# Altium schematic sheet wisp-5-peripherals.SchDoc
size A
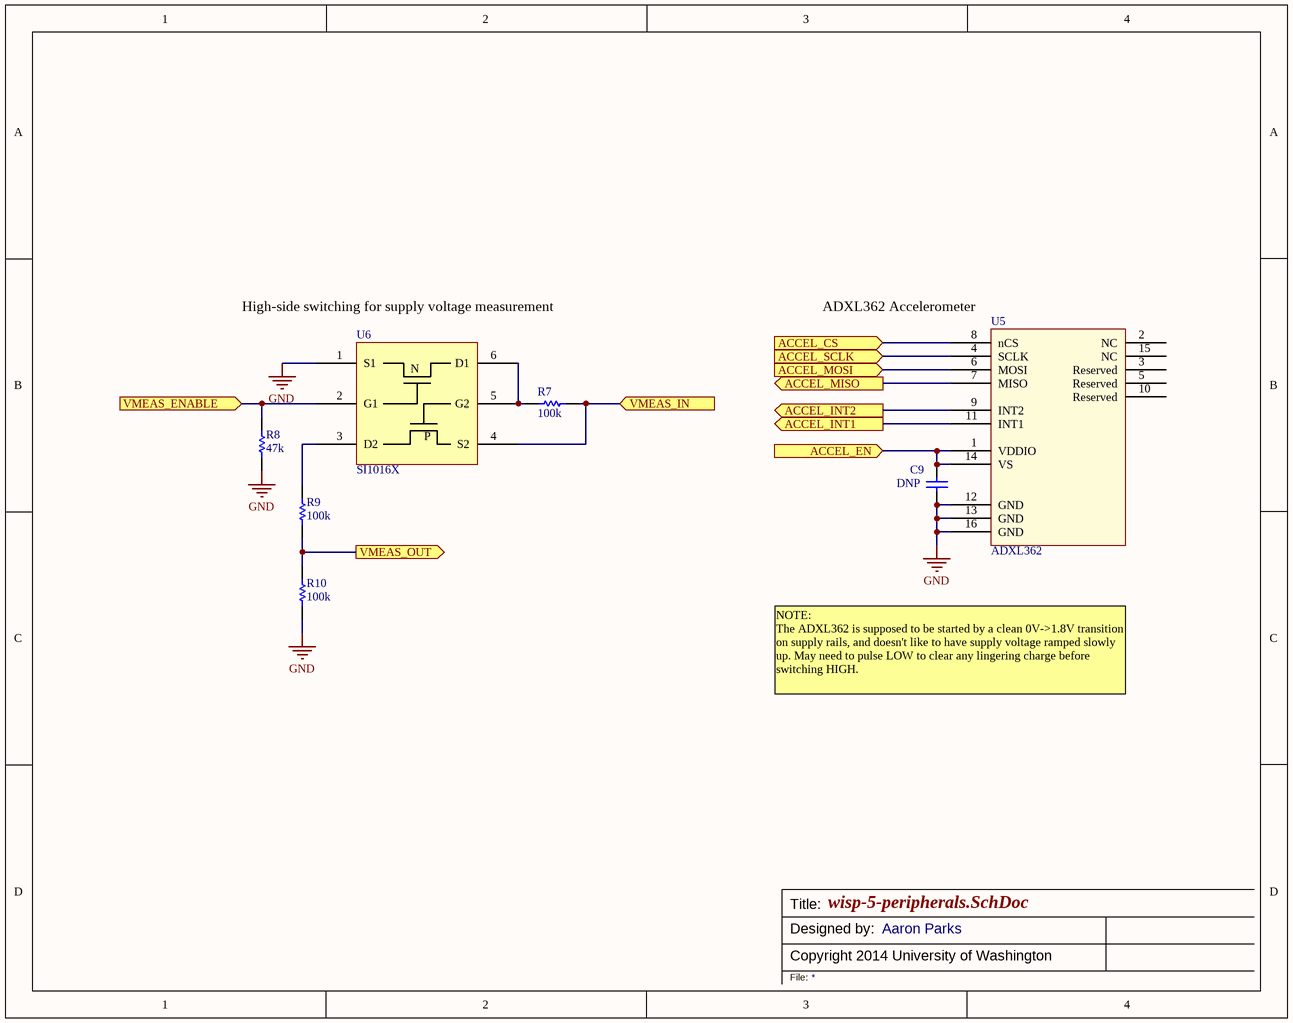
[diagram p0: wisp-5-peripherals.SchDoc]

## Parts
C9  Cap  [0402]  (value not drawn)
R7  value 100k  [0402]  (hidden comment: Res)
R8  value 47k  [0402]  (hidden comment: Res)
R9  value 100k  [0402]  (hidden comment: Res)
R10  value 100k  [0402]  (hidden comment: Res)
U5  ADXL362  [ADXL362]
U6  SI1016X  [SC-89-6 Vishay]

## Ports
ACCEL_CS (in), ACCEL_EN (in), ACCEL_INT1 (out), ACCEL_INT2 (out), ACCEL_MISO (out), ACCEL_MOSI (in), ACCEL_SCLK (in), VMEAS_ENABLE (in), VMEAS_IN (in), VMEAS_OUT (out)

## Nets
GND: C9.1 R8.1 R10.1 U5.12(GND) U5.13(GND) U5.16(GND) U6.1(S1)
ACCEL_CS: U5.8(nCS) ; port ACCEL_CS
ACCEL_EN: C9.2 U5.1(VDDIO) U5.14(VS) ; port ACCEL_EN
ACCEL_INT1: U5.11(INT1) ; port ACCEL_INT1
ACCEL_INT2: U5.9(INT2) ; port ACCEL_INT2
ACCEL_MISO: U5.7(MISO) ; port ACCEL_MISO
ACCEL_MOSI: U5.6(MOSI) ; port ACCEL_MOSI
ACCEL_SCLK: U5.4(SCLK) ; port ACCEL_SCLK
VMEAS_ENABLE: R8.2 U6.2(G1) ; port VMEAS_ENABLE
VMEAS_IN: R7.1 U6.4(S2) ; port VMEAS_IN
VMEAS_OUT: R9.1 R10.2 ; port VMEAS_OUT
NetR7_2: R7.2 U6.5(G2) U6.6(D1)
NetR9_2: R9.2 U6.3(D2)

Not connected (* = marked no-connect by the designer): U5 2(NC) 3(Reserved) 5(Reserved) 10(Reserved) 15(NC)

## Notes on the sheet
- (near U6) High-side switching for supply voltage measurement
- (near U5) ADXL362 Accelerometer
- NOTE:
  The ADXL362 is supposed to be started by a clean 0V->1.8V transition on supply rails, and doesn't like to have supply voltage ramped slowly up. May need to pulse LOW to clear any lingering charge before switching HIGH.
- Title:
- Copyright 2014 University of Washington
- Designed by:
- Aaron Parks
- File:
- (in symbol SI1016X) N; P

## Library data of the parts
C9 = Cap: Ceramic Capacitor (Surface Mount); Value: DNP; Digi-Key Part Number: *; Manufacturer Part Number: *; DNP: DNP; Rating: *
R7 R9 R10 = Res: Chip Resistor (Surface Mount); Manufacturer: Panasonic; Manufacturer Part Number: ERJ-2RKF1003X; Digi-Key Part Number: P100KLCT-ND; Rating: *
R8 = Res: Chip Resistor (Surface Mount); Manufacturer: Panasonic; Manufacturer Part Number: ERJ-2RKF4702X; Digi-Key Part Number: P47.0KLCT-ND; Rating: *
U5 = ADXL362: Analog Devices low power accelerometer; Manufacturer Part Number: ADXL362BCCZ-RL7; Digi-Key Part Number: ADXL362BCCZ-RL7CT-ND; Manufacturer: Analog Devices
U6 = SI1016X: NMOS and PMOS array; Manufacturer Part Number: SI1016X-T1-GE3; Manufacturer: Vishay Siliconix; Digi-Key Part Number: SI1016X-T1-GE3CT-ND